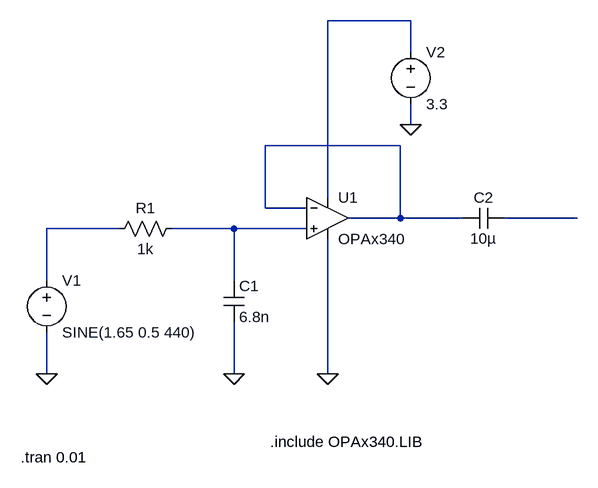
[diagram p0: schematic Analog_Output.asc]
Analog_Output.asc, the LTspice schematic file:
Version 4.1
SHEET 1 900 680
WIRE 640 -256 512 -256
WIRE 640 -208 640 -256
WIRE 640 -96 640 -128
WIRE 624 -64 416 -64
WIRE 512 16 512 -256
WIRE 416 32 416 -64
WIRE 480 32 416 32
WIRE 624 48 624 -64
WIRE 624 48 544 48
WIRE 720 48 624 48
WIRE 896 48 784 48
WIRE 192 64 80 64
WIRE 368 64 272 64
WIRE 480 64 368 64
WIRE 80 144 80 64
WIRE 368 144 368 64
WIRE 80 288 80 224
WIRE 368 288 368 208
WIRE 512 288 512 80
FLAG 80 288 0
FLAG 368 288 0
FLAG 512 288 0
FLAG 640 -96 0
SYMBOL voltage 80 128 R0
WINDOW 123 0 0 Left 0
WINDOW 39 0 0 Left 0
SYMATTR InstName V1
SYMATTR Value SINE(1.65 0.5 440)
SYMBOL res 288 48 R90
WINDOW 0 0 56 VBottom 2
WINDOW 3 32 56 VTop 2
SYMATTR InstName R1
SYMATTR Value 1k
SYMBOL cap 352 144 R0
SYMATTR InstName C1
SYMATTR Value 6.8n
SYMBOL OpAmps\\opamp2 512 -16 R0
SYMATTR InstName U1
SYMATTR Value OPAx340
SYMBOL voltage 640 -224 R0
WINDOW 123 0 0 Left 0
WINDOW 39 0 0 Left 0
SYMATTR InstName V2
SYMATTR Value 3.3
SYMBOL cap 784 32 R90
WINDOW 0 0 32 VBottom 2
WINDOW 3 32 32 VTop 2
SYMATTR InstName C2
SYMATTR Value 10µ
TEXT 424 392 Left 2 !.include OPAx340.LIB
TEXT 40 416 Left 2 !.tran 0.01

The netlist it stands for:
* Analog_Output.asc
V1 N004 0 SINE(1.65 0.5 440)
R1 N005 N004 1k
C1 N005 0 6.8n
X§U1 N005 N002 N001 0 N002 OPAx340  ; pins In+ In- V+ V- OUT
V2 N001 0 3.3
C2 N003 N002 10µ
.include OPAx340.LIB
.tran 0.01
.backanno
.end